# EasyEDA schematic SCH_CuboLab_2025-02-06.json
TITLE: CUBO V3; REV: 1.0; Date: 2024-02-27; Sheet: 1/1; Drawn By: MIGUEL,PORTO,GONZALO; Company: MEDIALAB
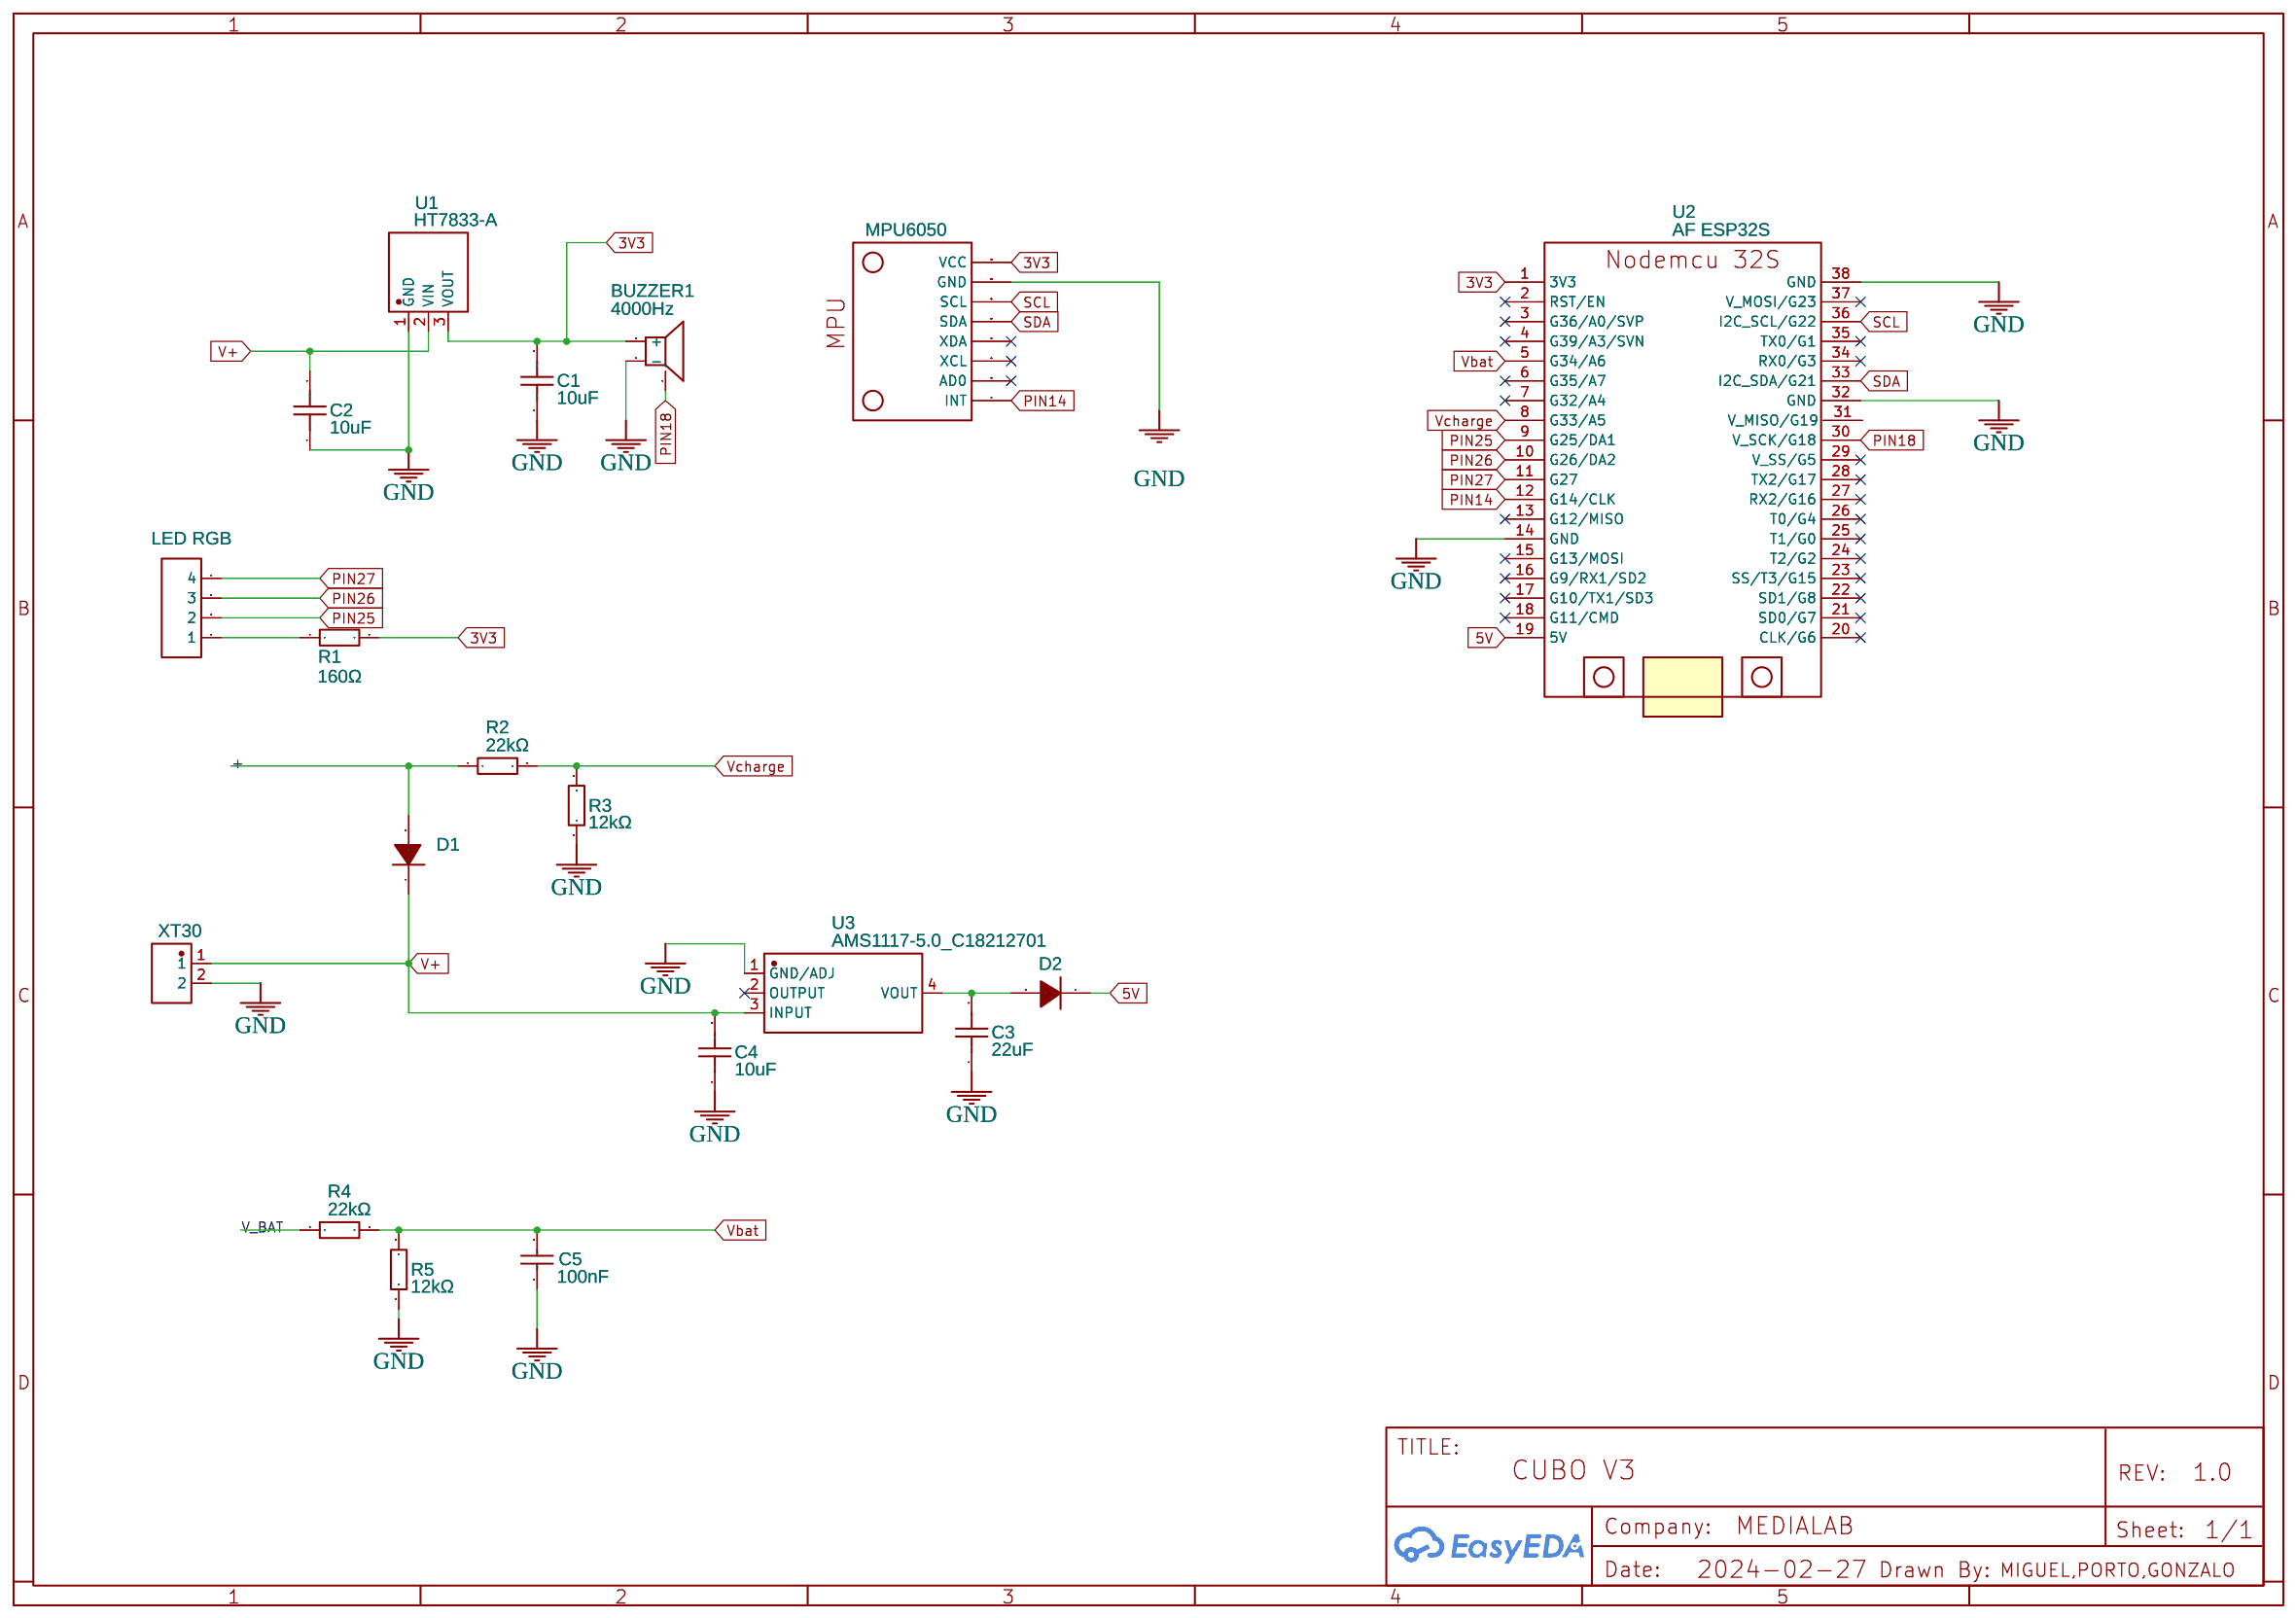
[diagram p0: schematic sheet]

## Parts
BUZZER1  4000Hz  [BUZ-SMD_3P-L5.2-W5.2-P3.50-BR]
C1  10uF  [C0805]
C2  10uF  [C0805]
C3  22uF  [C0805]
C4  10uF  [C0805]
C5  100nF  [C0805]
CN1  XT30  [CONN-TH_XT30U-M]
D1  PSBD1DF40V2H  [SOD-123FL_L2.7-W1.8-LS3.8-RD]
D2  PSBD1DF40V2H  [SOD-123FL_L2.7-W1.8-LS3.8-RD]
H1  LED RGB  [HEADER PAD 4]
MPU6050  MPU6050  [MPU6050-MODULE]
R1  160Ω  [R0805]
R2  22kΩ  [R0805]
R3  12kΩ  [R0805]
R4  22kΩ  [R0805]
R5  12kΩ  [R0805]
U1  HT7833-A  [SOT-89_L4.5-W2.5-P1.50-LS4.2-BR]
U2  AF ESP32S  [NODEMCU-ESP32S]
U3  AMS1117-5.0_C18212701  [SOT-223-3_L6.5-W3.4-P2.30-LS7.0-BR]

## Library data of the parts
BUZZER1 = MLT-5030: Supplier: LCSC; Manufacturer: 华能; Supplier Part: C95297; JLCPCB Part Class: Extended Part
C1 C4 = CS2012X7R105K500NRE: Contributor: LCSC; Supplier: LCSC; Supplier Part: C1713; Manufacturer: SAMSUNG(三星); Manufacturer Part: CL21A106KOQNNNE; JLCPCB Part Class: Extended Part; link: https://lcsc.com/eda_search?q=C516002&%26type=1&ref=editor
C2 = CS2012X7R105K500NRE: Contributor: LCSC; Supplier: LCSC; Supplier Part: C1713; Manufacturer: SAMSUNG(三星); Manufacturer Part: CL21A106KOQNNNE; JLCPCB Part Class: Extended Part
C3 = CS2012X7R105K500NRE: Contributor: LCSC; Supplier: LCSC; Supplier Part: C29277; Manufacturer: SAMSUNG(三星); Manufacturer Part: CL21A226MPQNNNE; JLCPCB Part Class: Extended Part; link: https://lcsc.com/eda_search?q=C516002&%26type=1&ref=editor
C5 = CL21B104KBCNNNC: Supplier: LCSC; Manufacturer: SAMSUNG(三星); Supplier Part: C1711; JLCPCB Part Class: Extended Part
CN1 = XT30U-M: Contributor: lcsc; Supplier: LCSC; Supplier Part: C99101; Manufacturer: AMASS(艾迈斯); JLCPCB Part Class: Extended Part
D1 D2 = PSBD1DF40V2H: Contributor: LCSC; Supplier: LCSC; Supplier Part: C492734; Manufacturer: Prisemi(芯导); JLCPCB Part Class: Extended Part
H1 = Header 4: Supplier Part: C225501; Supplier: LCSC; Contributor: Christophe PASQUIER
MPU6050 = MPU6050: sourceId: 1T5FDZYC8; Contributor: jmmb18797
R1 = 0805W8F1600T5E: Supplier: LCSC; Manufacturer: UNI-ROYAL(厚声); Supplier Part: C25269; JLCPCB Part Class: Extended Part
R2 R4 = 0805W8F2202T5E: Supplier: LCSC; Manufacturer: UNI-ROYAL(厚声); Supplier Part: C17560; JLCPCB Part Class: Basic Part; link: https://lcsc.com/eda_search?q=C17560&%26type=1&ref=editor
R3 R5 = 0805W8F1202T5E: Supplier: LCSC; Manufacturer: UNI-ROYAL(厚声); Supplier Part: C17444; JLCPCB Part Class: Basic Part; link: https://lcsc.com/eda_search?q=C17444&%26type=1&ref=editor
U1 = HT7833-A: Contributor: LCSC; Supplier: LCSC; Supplier Part: C347195; Manufacturer: UMW(友台半导体); JLCPCB Part Class: Extended Part
U2 = AF ESP32S: Manufacturer Part: NodeMCU ESP32S; Contributor: kilimaro
U3 = AMS1117-5.0_C18212701: Supplier: LCSC; Supplier Part: C18212701; Manufacturer: TECH PUBLIC(台舟); Manufacturer Part: AMS1117-5.0; Contributor: lcsc; link: https://lcsc.com/eda_search?q=C18212701&%26type=1&ref=editor

## Nets
3V3: BUZZER1.2(+) C1.2 MPU6050.VCC R1.2 U1.3(VOUT) U2.1(3V3)
5V: D2.1(-) U2.19(5V)
GND: BUZZER1.3(-) C1.1 C2.1 C3.1 C4.1 C5.1 CN1.2 MPU6050.GND R3.1 R5.1 U1.1(GND) U2.14(GND) U2.32(GND) U2.38(GND) U3.1(GND/ADJ)
Vbat: C5.2 R4.2 R5.2 U2.5(G34/A6)
+: D1.2(+) R2.1
PIN14: MPU6050.INT U2.12(G14/CLK)
PIN18: BUZZER1.1(NC) U2.30(V_SCK/G18)
PIN25: H1.2 U2.9(G25/DA1)
PIN26: H1.3 U2.10(G26/DA2)
PIN27: H1.4 U2.11(G27)
SCL: MPU6050.SCL U2.36(I2C SCL/G22)
SDA: MPU6050.SDA U2.33(I2C SDA/G21)
V+: C2.2 C4.2 CN1.1 D1.1(-) U1.2(VIN) U3.3(INPUT)
V_BAT: R4.1
Vcharge: R2.2 R3.2 U2.8(G33/A5)
Net-(C3-2): C3.2 D2.2(+) U3.4(VOUT)
Net-(H1-1): H1.1 R1.1

Not connected (* = marked no-connect by the designer): MPU6050 AD0* XCL* XDA*; U2 2(RST/EN)* 3(G36/A0/SVP)* 4(G39/A3/SVN)* 6(G35/A7)* 7(G32/A4)* 13(G12/MISO)* 15(G13/MOSI)* 16(G9/RX1/SD2)* 17(G10/TX1/SD3)* 18(G11/CMD)* 20(CLK/G6)* 21(SD0/G7)* 22(SD1/G8)* 23(SS/T3/G15)* 24(T2/G2)* 25(T1/G0)* 26(T0/G4)* 27(RX2/G16)* 28(TX2/G17)* 29(V_SS/G5)* 31(V_MISO/G19) 34(RX0/G3)* 35(TX0/G1)* 37(V_MOSI/G23)*; U3 2(OUTPUT)*
